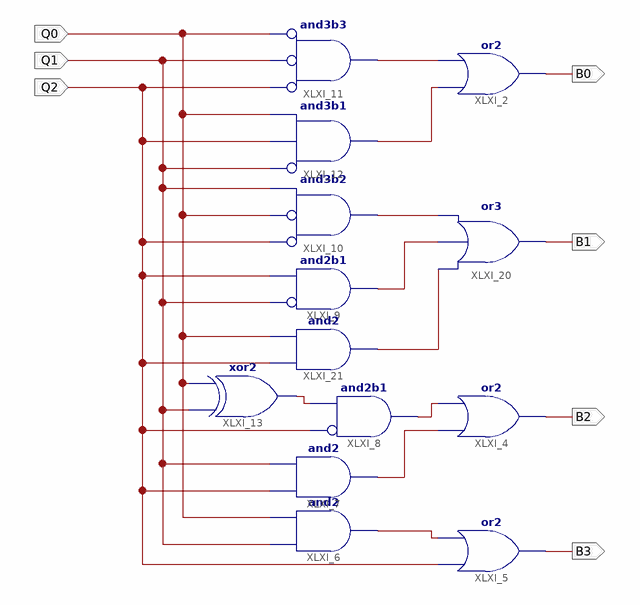
[diagram p0: schematic sheet 1]
// Xilinx ISE schematic dekoderL1.sch (spartan3e) as structural Verilog: 13 symbols, 7 ports
module dekoderL1 (
  input  Q0,
  input  Q1,
  input  Q2,
  output B0,
  output B3,
  output B2,
  output B1
);

  wire XLXN_1, XLXN_3, XLXN_4, XLXN_5, XLXN_6, XLXN_7, XLXN_12, XLXN_19, XLXN_50;

  and XLXI_11 (XLXN_1, ~Q2, ~Q1, ~Q0);  // and3b3
  and XLXI_10 (XLXN_3, ~Q2, ~Q0, Q1);  // and3b2
  and XLXI_9 (XLXN_4, ~Q1, Q2);  // and2b1
  or XLXI_2 (B0, XLXN_19, XLXN_1);
  and XLXI_12 (XLXN_19, ~Q1, Q2, Q0);  // and3b1
  or XLXI_5 (B3, Q2, XLXN_7);
  and XLXI_6 (XLXN_7, Q1, Q0);
  and XLXI_7 (XLXN_6, Q2, Q1);
  or XLXI_4 (B2, XLXN_6, XLXN_5);
  and XLXI_8 (XLXN_5, ~Q2, XLXN_12);  // and2b1
  xor XLXI_13 (XLXN_12, Q1, Q0);
  or XLXI_20 (B1, XLXN_50, XLXN_4, XLXN_3);
  and XLXI_21 (XLXN_50, Q2, Q0);
endmodule
